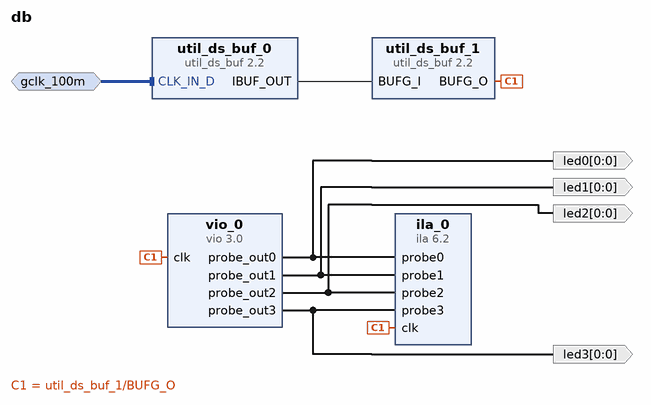
[diagram p0: block diagram of the top level]
# Vivado block design db, xcvu13p-fhgb2104-2-e, Vivado 2024.2_AR37126
create_bd_design db

create_bd_intf_port -mode Slave -vlnv xilinx.com:interface:diff_clock_rtl:1.0 gclk_100m
create_bd_port -dir O -from 0 -to 0 led0
create_bd_port -dir O -from 0 -to 0 led1
create_bd_port -dir O -from 0 -to 0 led2
create_bd_port -dir O -from 0 -to 0 led3

create_bd_cell -type ip -vlnv xilinx.com:ip:util_ds_buf:2.2 util_ds_buf_0
create_bd_cell -type ip -vlnv xilinx.com:ip:util_ds_buf:2.2 util_ds_buf_1
set_property -dict {CONFIG.C_BUF_TYPE BUFG} [get_bd_cells util_ds_buf_1]
create_bd_cell -type ip -vlnv xilinx.com:ip:vio:3.0 vio_0
set_property -dict [list \
  CONFIG.C_NUM_PROBE_IN 0 \
  CONFIG.C_NUM_PROBE_OUT 4 \
  CONFIG.C_PROBE_OUT0_INIT_VAL 0x1 \
  CONFIG.C_PROBE_OUT1_INIT_VAL 0x1 \
  CONFIG.C_PROBE_OUT2_INIT_VAL 0x1 \
  CONFIG.C_PROBE_OUT3_INIT_VAL 0x1 \
  CONFIG.C_PROBE_OUT4_INIT_VAL 0x1 \
  CONFIG.C_PROBE_OUT5_INIT_VAL 0x1 \
  CONFIG.C_PROBE_OUT6_INIT_VAL 0x1 \
  CONFIG.C_PROBE_OUT7_INIT_VAL 0x1 \
] [get_bd_cells vio_0]
create_bd_cell -type ip -vlnv xilinx.com:ip:ila:6.2 ila_0
set_property -dict {CONFIG.C_MONITOR_TYPE Native CONFIG.C_NUM_OF_PROBES 4} [get_bd_cells ila_0]

# ---- connections ----

connect_bd_intf_net [get_bd_intf_pins util_ds_buf_0/CLK_IN_D] [get_bd_intf_ports gclk_100m]
connect_bd_net [get_bd_pins util_ds_buf_0/IBUF_OUT] [get_bd_pins util_ds_buf_1/BUFG_I]
connect_bd_net [get_bd_pins util_ds_buf_1/BUFG_O] [get_bd_pins ila_0/clk] [get_bd_pins vio_0/clk]
connect_bd_net [get_bd_pins vio_0/probe_out0] [get_bd_ports led0] [get_bd_pins ila_0/probe0]
connect_bd_net [get_bd_pins vio_0/probe_out1] [get_bd_ports led1] [get_bd_pins ila_0/probe1]
connect_bd_net [get_bd_pins vio_0/probe_out2] [get_bd_ports led2] [get_bd_pins ila_0/probe2]
connect_bd_net [get_bd_pins vio_0/probe_out3] [get_bd_ports led3] [get_bd_pins ila_0/probe3]

validate_bd_design
save_bd_design
